# EAGLE design sensor board (EAGLE 7.4.0)
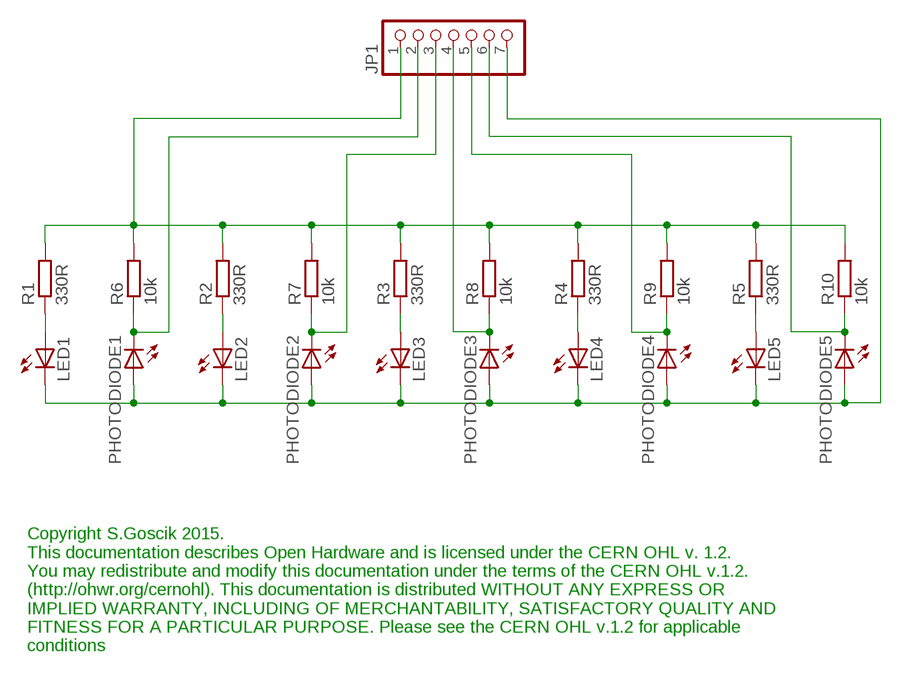
[diagram p0: schematic, sheet 1]

## Parts
JP1  PINHD-1X7  [1X07]
LED1  LED3MM  [LED3MM]
LED2  LED3MM  [LED3MM]
LED3  LED3MM  [LED3MM]
LED4  LED3MM  [LED3MM]
LED5  LED3MM  [LED3MM]
PHOTODIODE1  LED3MM  [LED3MM]
PHOTODIODE2  LED3MM  [LED3MM]
PHOTODIODE3  LED3MM  [LED3MM]
PHOTODIODE4  LED3MM  [LED3MM]
PHOTODIODE5  LED3MM  [LED3MM]
R1  330R  R-EU_0207/10  [0207/10]
R2  330R  R-EU_0207/10  [0207/10]
R3  330R  R-EU_0207/10  [0207/10]
R4  330R  R-EU_0207/10  [0207/10]
R5  330R  R-EU_0207/10  [0207/10]
R6  10k  R-EU_0207/10  [0207/10]
R7  10k  R-EU_0207/10  [0207/10]
R8  10k  R-EU_0207/10  [0207/10]
R9  10k  R-EU_0207/10  [0207/10]
R10  10k  R-EU_0207/10  [0207/10]

## Nets
N$1: LED1.A R1.1
N$3: LED2.A R2.1
N$4: JP1.3 PHOTODIODE2.K(C) R7.1
N$5: LED3.A R3.1
N$6: JP1.4 PHOTODIODE3.K(C) R8.1
N$7: LED4.A R4.1
N$8: JP1.5 PHOTODIODE4.K(C) R9.1
N$9: LED5.A R5.1
N$10: JP1.6 PHOTODIODE5.K(C) R10.1
N$11: JP1.1 R1.2 R2.2 R3.2 R4.2 R5.2 R6.2 R7.2 R8.2 R9.2 R10.2
N$12: JP1.7 LED1.K(C) LED2.K(C) LED3.K(C) LED4.K(C) LED5.K(C) PHOTODIODE1.A PHOTODIODE2.A PHOTODIODE3.A PHOTODIODE4.A PHOTODIODE5.A
N$13: JP1.2 PHOTODIODE1.K(C) R6.1

## Notes on the sheet
- Copyright S.Goscik 2015. 
  This documentation describes Open Hardware and is licensed under the CERN OHL v. 1.2. 
  You may redistribute and modify this documentation under the terms of the CERN OHL v.1.2.
  (http://ohwr.org/cernohl). This documentation is distributed WITHOUT ANY EXPRESS OR 
  IMPLIED WARRANTY, INCLUDING OF MERCHANTABILITY, SATISFACTORY QUALITY AND
  FITNESS FOR A PARTICULAR PURPOSE. Please see the CERN OHL v.1.2 for applicable 
  conditions

## Library data of the parts
JP1 = pinhead:PINHD-1X7: PIN HEADER
LED1-LED5 PHOTODIODE1-PHOTODIODE5 = led:LED: LED OSRAM: - CHIPLED LG R971, LG N971, LY N971, LG Q971, LY Q971, LO R971, LY R971 LH N974, LH R974 LS Q976, LO Q976, LY Q976 LO Q996 - Hyper CHIPLED LW Q18S LB Q993, LB Q99A, LB R99A - SideLED LS A670, LO A670, LY A670, LG A670, LP A670 LB A673, LV A673, LT A673, LW A673 LH A674 LY A675 LS A676, LA A676, LO A676, LY A676, LW A676 LS A679, LY A679, LG A679 - Hyper Micro SIDELED® LS Y876, LA Y876, LO Y876, LY Y876 LT Y87S - SmartLED LW L88C, LW L88S LB L89C, LB L89S, LG L890 LS L89K, LO L89K, LY L89K LS L896, LA L896, LO L896, LY L896 - TOPLED LS T670, LO T670, LY T670, LG T670, LP T670 LSG T670, LSP T670, LSY T670, LOP T670, LYG T670 LG T671, LOG T671, LSG T671 LB T673, LV T673, LT T673, LW T673 LH T674 LS T676, LA T676, LO T676, LY T676, LB T676, LH T676, LSB T676, LW T676 LB T67C, LV T67C, LT T67C, LS T67K, LO T67K, LY T67K, LW E67C LS E67B, LA E67B, LO E67B, LY E67B, LB E67C, LV E67C, LT E67C LW T67C LS T679, LY T679, LG T679 LS T770, LO T770, LY T770, LG T770, LP T770 LB T773, LV T773, LT T773, LW T773 LH T774 LS E675, LA E675, LY E675, LS T675 LS T776, LA T776, LO T776, LY T776, LB T776 LHGB T686 LT T68C, LB T68C - Hyper Mini TOPLED® LB M676 - Mini TOPLED Santana® LG M470 LS M47K, LO M47K, LY M47K Source: http://www.osram.convergy.de LUXEON: - LUMILED® LXK2-PW12-R00, LXK2-PW12-S00, LXK2-PW14-U00, LXK2-PW14-V00 LXK2-PM12-R00, LXK2-PM12-S00, LXK2-PM14-U00 LXK2-PE12-Q00, LXK2-PE12-R00, LXK2-PE12-S00, LXK2-PE14-T00, LXK2-PE14-U00 LXK2-PB12-K00, LXK2-PB12-L00, LXK2-PB12-M00, LXK2-PB14-N00, LXK2-PB14-P00, LXK2-PB14-Q00 LXK2-PR12-L00, LXK2-PR12-M00, LXK2-PR14-Q00, LXK2-PR14-R00 LXK2-PD12-Q00, LXK2-PD12-R00, LXK2-PD12-S00 LXK2-PH12-R00, LXK2-PH12-S00 LXK2-PL12-P00, LXK2-PL12-Q00, LXK2-PL12-R00 Source: www.luxeon.com KINGBRIGHT: KA-3528ASYC Source: www.kingbright.com
R1-R10 = rcl:R-EU_: RESISTOR, European symbol

## Board
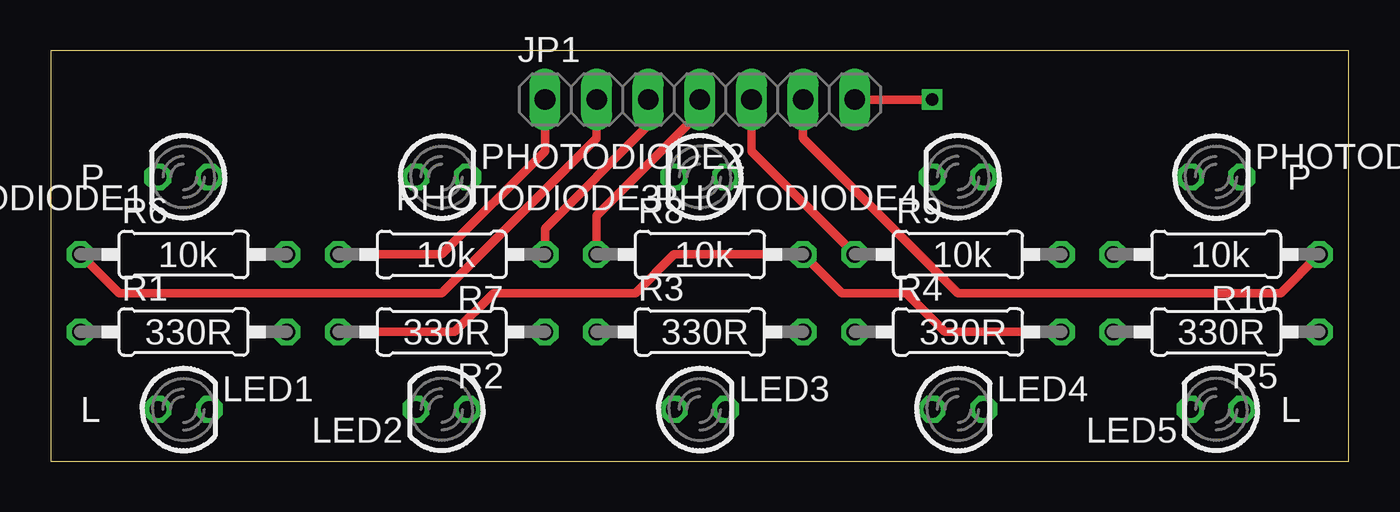
[diagram p1: board, top side]
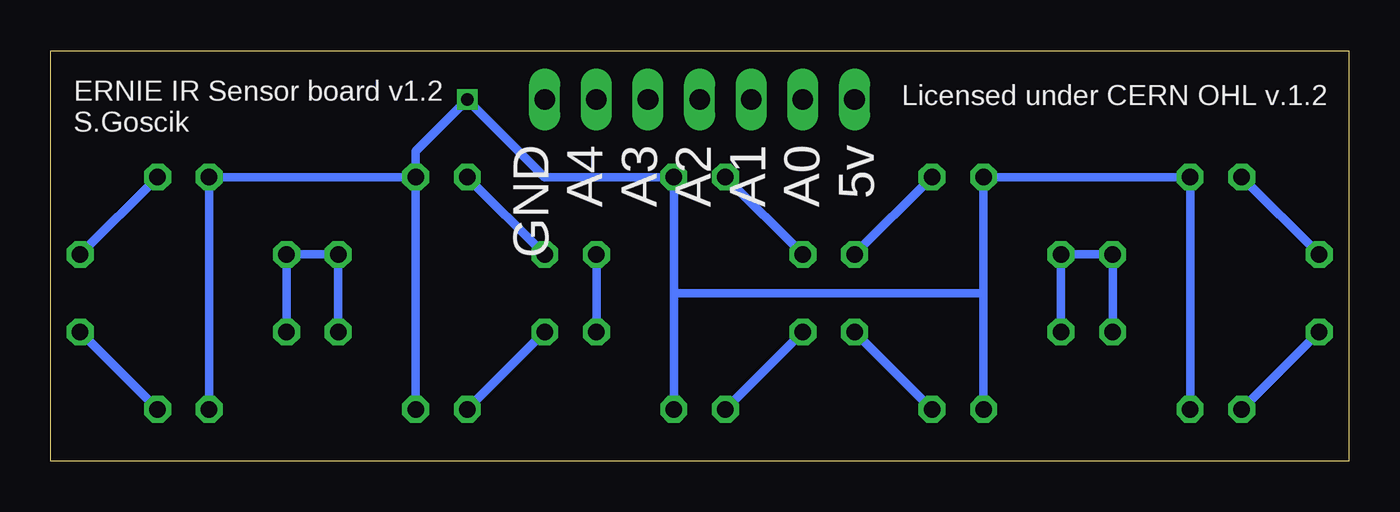
[diagram p2: board, bottom side, seen from below]

Size 63.85 x 20.18 mm. Coordinates in mm from the lower left corner, seen from the top.
Outline: 0,0 63.85,0 63.85,20.18 0,20.18 0,0
Copper layers (1*16): Top 0.035mm / dielectric 1.5mm / Bottom 0.035mm
Design rules "default": minimum track width 10mil, minimum drill 24mil, track to track 8mil, track to pad 8mil, pad to pad 8mil, via to via 8mil, smd to smd 8mil, copper to edge 40mil, drill to drill 8mil, minimum pad ring 10mil, minimum via ring 8mil, stop-mask expansion 4mil, vias tented up to drill 0mil, thermal gap 10mil

### Footprints (pad centres in the part's own frame; a part is rotated, then mirrored left to right if it is on the bottom)
1X07 = drill 1.016 long: 1 -7.62,0; 2 -5.08,0; 3 -2.54,0; 4 0,0; 5 2.54,0; 6 5.08,0; 7 7.62,0
LED3MM = drill 0.813 octagon: A -1.27,0; K 1.27,0
0207/10 = drill 0.813 octagon: 1 -5.08,0; 2 5.08,0

### Placement (x,y rotation side)
JP1  31.93,17.78 0 top
LED1  6.53,2.54 0 top
LED2  19.23,2.54 180 top
LED3  31.93,2.54 0 top
LED4  44.63,2.54 0 top
LED5  57.33,2.54 180 top
PHOTODIODE1  6.53,13.97 180 top
PHOTODIODE2  19.23,13.97 0 top
PHOTODIODE3  31.93,13.97 180 top
PHOTODIODE4  44.63,13.97 180 top
PHOTODIODE5  57.33,13.97 0 top
R1  6.53,6.35 0 top
R2  19.23,6.35 180 top
R3  31.93,6.35 0 top
R4  44.63,6.35 0 top
R5  57.33,6.35 180 top
R6  6.53,10.16 0 top
R7  19.23,10.16 180 top
R8  31.93,10.16 0 top
R9  44.63,10.16 0 top
R10  57.33,10.16 180 top

### Tracks (layer width: path | path; a pad name or v marks a point on that pad's centre or on a via)
N$1
  Bottom 0.406: R1.1 LED1.A
N$3
  Bottom 0.406: R2.1 LED2.A
N$4
  Top 0.406: JP1.3 29.39,16.51 24.31,11.43 R7.1
  Bottom 0.406: PHOTODIODE2.K R7.1
N$5
  Bottom 0.406: R3.1 LED3.A
N$6
  Top 0.406: JP1.4 31.93,17.14 26.85,12.06 R8.1
  Bottom 0.406: R8.1 PHOTODIODE3.K
N$7
  Bottom 0.406: R4.1 LED4.A
N$8
  Top 0.406: JP1.5 34.47,15.24 R9.1
  Bottom 0.406: PHOTODIODE4.K R9.1
N$9
  Bottom 0.406: LED5.A R5.1
N$10
  Top 0.406: R10.1 60.51,8.26 44.63,8.26 37.01,15.88 JP1.6
  Bottom 0.406: R10.1 PHOTODIODE5.K
N$11
  Top 0.406: JP1.1 24.31,15.24 19.23,10.16 R7.2 | R2.2 19.87,6.35 21.77,8.26 28.76,8.26 30.66,10.16 R8.2 38.92,8.26 42.09,8.26 44,6.35 R4.2
  Bottom 0.406: R1.2 R6.2 R7.2 R2.2 | R4.2 R9.2 R10.2 R5.2 | R8.2 R3.2
N$12  (via drill 0.6)
  Top 0.406: v43.36,17.78 JP1.7
  Bottom 0.406: LED1.K PHOTODIODE1.A PHOTODIODE2.A 17.96,8.26 | PHOTODIODE4.A PHOTODIODE5.A LED5.K | LED4.K PHOTODIODE4.A | 33.2,8.26 PHOTODIODE3.A 39.55,13.97 v43.36,17.78 45.9,15.24 PHOTODIODE4.A | 33.2,8.26 LED3.K | LED2.K 17.96,8.26 | 17.96,8.26 33.2,8.26
N$13
  Top 0.406: R6.1 3.36,8.26 19.23,8.26 26.85,15.88 JP1.2
  Bottom 0.406: R6.1 PHOTODIODE1.K

### Text on the board
Document: Copyright S.Goscik 2015. / This documentation describes Open Hardware and is licensed under the CERN OHL v. 1.2. / You may redistribute and modify this documentation under the terms of the CERN OHL v.1.2. / (http://ohwr.org/cernohl). This documentation is distributed WITHOUT ANY EXPRESS OR / IMPLIED WARRANTY, INCLUDING OF MERCHANTABILITY, SATISFACTORY QUALITY AND / FITNESS FOR A PARTICULAR PURPOSE. Please see the CERN OHL v.1.2 for applicable / conditions
bSilk: Licensed under CERN OHL v.1.2 | GND / A4 / A3 / A2 / A1 / A0 / 5v | ERNIE IR Sensor board v1.2 / S.Goscik
tSilk: P | P | 10k | 10k | 10k | 10k | 10k | 330R | 330R | 330R | 330R | 330R | L | L